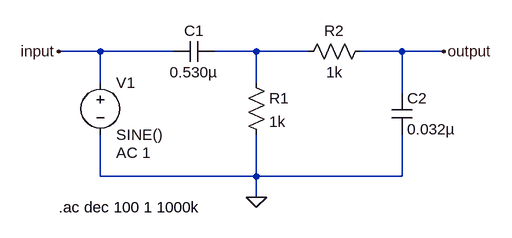
[diagram p0: schematic band-pass-filter.asc]
band-pass-filter.asc, the LTspice schematic file:
Version 4
SHEET 1 880 680
WIRE -32 96 -96 96
WIRE 80 96 -32 96
WIRE 208 96 144 96
WIRE 288 96 208 96
WIRE 432 96 368 96
WIRE 496 96 432 96
WIRE -32 144 -32 96
WIRE 208 144 208 96
WIRE 432 160 432 96
WIRE -32 288 -32 224
WIRE 208 288 208 224
WIRE 208 288 -32 288
WIRE 432 288 432 224
WIRE 432 288 208 288
WIRE 208 320 208 288
FLAG 208 320 0
FLAG 496 96 output
FLAG -96 96 input
SYMBOL voltage -32 128 R0
WINDOW 123 24 124 Left 2
WINDOW 39 0 0 Left 0
SYMATTR Value2 AC 1
SYMATTR InstName V1
SYMATTR Value SINE()
SYMBOL cap 144 80 R90
WINDOW 0 0 32 VBottom 2
WINDOW 3 32 32 VTop 2
SYMATTR InstName C1
SYMATTR Value 0.530µ
SYMBOL res 192 128 R0
SYMATTR InstName R1
SYMATTR Value 1k
SYMBOL res 384 80 R90
WINDOW 0 0 56 VBottom 2
WINDOW 3 32 56 VTop 2
SYMATTR InstName R2
SYMATTR Value 1k
SYMBOL cap 416 160 R0
SYMATTR InstName C2
SYMATTR Value 0.032µ
TEXT -96 336 Left 2 !.ac dec 100 1 1000k

The netlist it stands for:
* band-pass-filter.asc
V1 input 0 SINE() AC 1
C1 N001 input 0.530µ
R1 N001 0 1k
R2 output N001 1k
C2 output 0 0.032µ
.ac dec 100 1 1000k
.backanno
.end

* Results of the author's LTspice run, read from the files saved beside the schematic
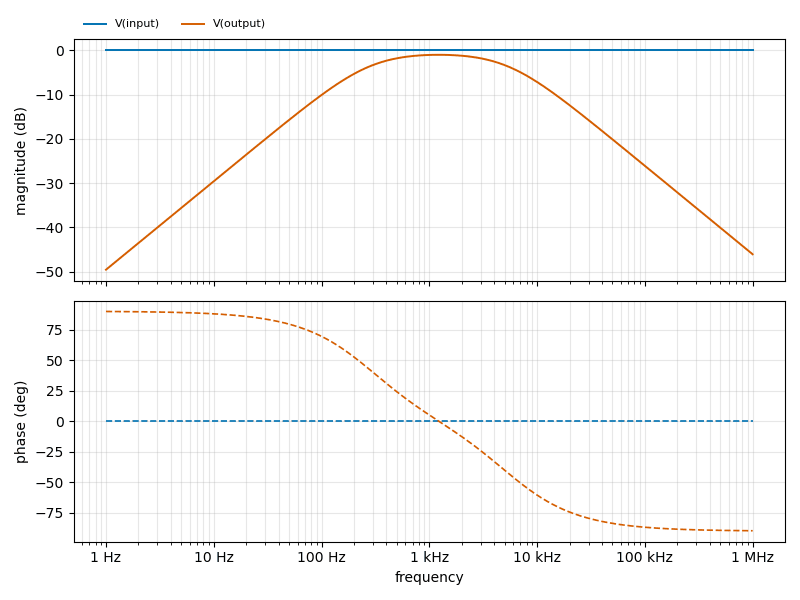
[diagram p1: AC Analysis of band-pass-filter.asc, plotted from the saved traces]
* AC Analysis, 1 run:
*   V(input): 0.00 dB at 1 Hz, 0.00 dB at 1 MHz, peak 0.00 dB at 1 Hz
*   V(output): -49.55 dB at 1 Hz, -46.07 dB at 1 MHz, peak -0.99 dB at 1.23 kHz, 3 dB below the peak at 256.2 Hz and 5.83 kHz